# Altium schematic sheet Power - Regulation.SchDoc
size A; SheetNumber: 4; SheetTotal: 11
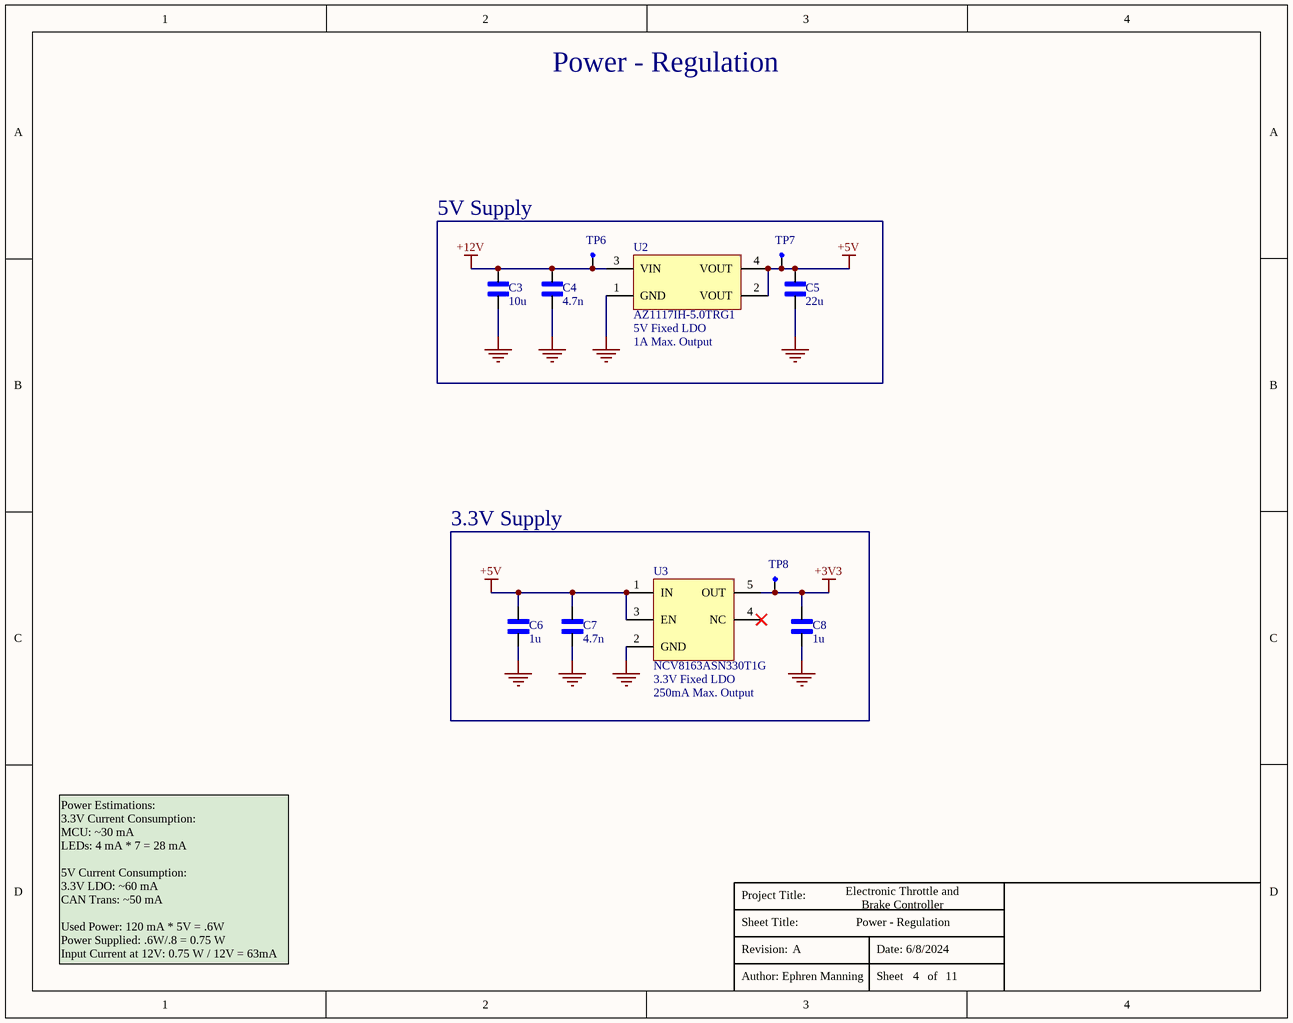
[diagram p0: Power - Regulation.SchDoc]

## Parts
C3  10u  [CAP_1210-Footprint-1]
C4  4.7n  [CAP_0402-Footprint-1]
C5  22u  [CAP_1206-Footprint-1]
C6  1u  [CAP_0805-Footprint-1]
C7  4.7n  [CAP_0402-Footprint-1]
C8  1u  [CAP_0805-Footprint-1]
TP6  SMD Testpoint  [SMD Testpoint-Footprint-1]  (value not drawn)
TP7  SMD Testpoint  [SMD Testpoint-Footprint-1]  (value not drawn)
TP8  SMD Testpoint  [SMD Testpoint-Footprint-1]  (value not drawn)
U2  AZ1117IH-5.0TRG1  [SOT230P700X180-4N]
U3  NCV8163ASN330T1G  [SOT95P275X110-5N]

## Blocks framed on the sheet
5V Supply: C3-C5 TP6 TP7 U2
3.3V Supply: C6-C8 TP8 U3

## Nets
+3V3: C8.2 TP8.1 U3.5(OUT)
+5V: C5.2 C6.2 C7.2 TP7.1 U2.2(VOUT) U2.4(VOUT) U3.1(IN) U3.3(EN)
+12V: C3.2 C4.2 TP6.1 U2.3(VIN)
GND: C3.1 C4.1 C5.1 C6.1 C7.1 C8.1 U2.1(GND) U3.2(GND)

Not connected (* = marked no-connect by the designer): U3 4(NC)*

## Notes on the sheet
- Power - Regulation
- (near U2) 5V Fixed LDO
- (near U2) 1A Max. Output
- (near U3) 3.3V Fixed LDO
- (near U3) 250mA Max. Output
- Electronic Throttle and
  Brake Controller
- Power Estimations:
  3.3V Current Consumption:
  MCU: ~30 mA
  LEDs: 4 mA * 7 = 28 mA
  5V Current Consumption:
  3.3V LDO: ~60 mA
  CAN Trans: ~50 mA
  Used Power: 120 mA * 5V = .6W
  Power Supplied: .6W/.8 = 0.75 W
  Input Current at 12V: 0.75 W / 12V = 63mA
- A
- 6/8/2024
- Ephren Manning
- 4
- 11
- Project Title:
- Sheet Title:
- Revision:
- Date:
- Author:
- Sheet        of

## Library data of the parts
C3 = CMP-00102-1: 10uF 35V 10% 1210 MLCC; Manufacturer 1: Samsung Electro-Mechanics; Manufacturer Part Number 1: CL32B106KLJNNNE; Digikey Part Number: 1276-3389-1-ND
C4 C7 = CMP-00072-1: 4.7nF 100V 10% 0402 Ceramic Capacitor; Manufacturer 1: Murata Electronics; Manufacturer Part Number 1: GCM155R72A472KA37D; Digikey Part Number: 490-4765-1-ND
C5 = CMP-00099-3: 22uF 10V 20% 1206 MLCC; Manufacturer 1: Samsung Electro-Mechanics; Manufacturer Part Number 1: CL31B226MPHNNNE; Digikey Part Number: 1276-3148-1-ND
C6 C8 = CMP-00097-2: 1uF 25V 10% 0805 MLCC; Manufacturer 1: Samsung Electro-Mechanics; Manufacturer Part Number 1: CL21B105KAFNNNE; Digikey Part Number: 1276-1066-1-ND
TP6-TP8 = CMP-00095-4: Flat 50x50mil Test Point
U2 = CMP-00103-1: 5V Fixed Linear Regulator; Manufacturer 1: Diodes Incorporated; Manufacturer Part Number1: AZ1117IH-5.0TRG1; Digikey Part Number: AZ1117IH-5.0TRG1DICT-ND
U3 = CMP-00082-1: 3.3V LDO, Ultra Low Noise 5.5V Max Vin; Manufacturer 1: onsemi; Manufacturer Part Number 1: NCV8163ASN330T1G; Digikey Part Number: NCV8163ASN330T1GOSCT-ND